# Altium project P1.PrjPcb
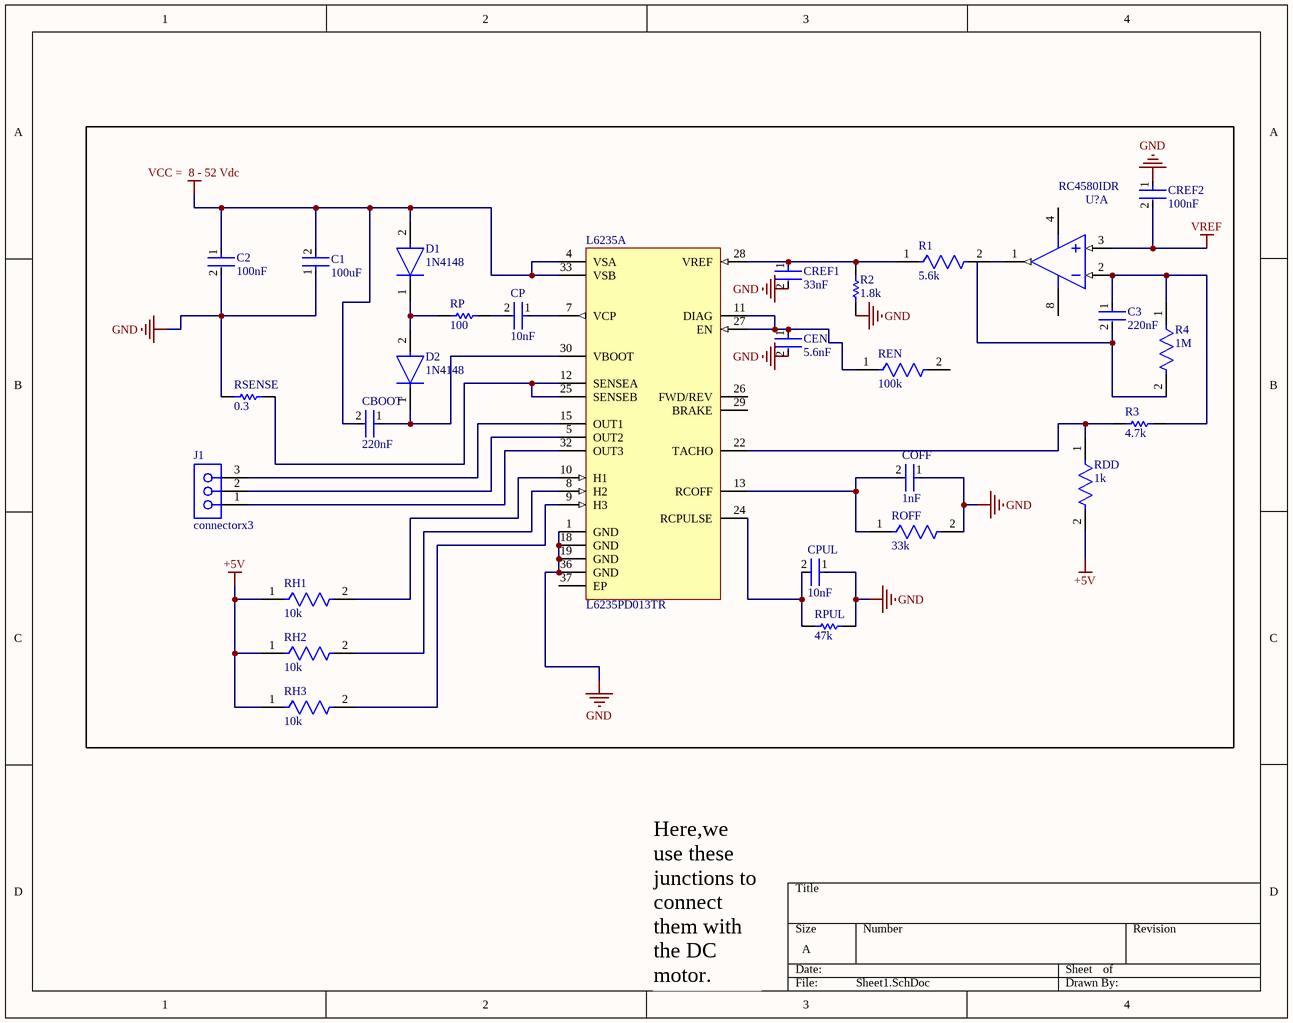
[diagram p0: Sheet1.SchDoc]
1 sheet, 28 parts. Net scope: global (net labels, ports and power ports of the same name join across sheets).
Board file: PCB1.PcbDoc

## Sheet Sheet1.SchDoc
size A; SheetNumber: 1; SheetTotal: 1

### Parts
C1  100uF  [FP-GRM32-0_3-MFG]
C2  100nF  [FP-GRM033-0_03-MFG]
C3  220nF  [FP-1812-L_4_5_0_3-W_3_2_0-MFG]
CBOOT  220nF  [FP-1812-L_4_5_0_3-W_3_2_0-MFG]
CEN  5.6nF  [FP-CC0603-DA-MFG]
COFF  1nF  [FP-0603-L_1_6_0_15-W_0_81-IPC_A]
CP  10nF  [FP-C0805C-DN-MFG]
CPUL  10nF  [FP-C0805C-DN-MFG]
CREF1  33nF  [FP-1206-L_3_2_0_2-W_1_6_0-IPC_B]
CREF2  100nF  [FP-GRM033-0_03-MFG]
D1  1N4148  [FP-017AG-MFG]
D2  1N4148  [FP-017AG-MFG]
J1  connectorx3  [SMTC-SSW-103-22-X-S-VS]
L6235  L6235PD013TR  [STM-PowerSO36-36_V1]  (part A of 2)
R1  5.6k  [FP-ERJ2RK-IPC_A]
R2  1.8k  [RESC1005X40X25LL10T10]
R3  4.7k  [RESC1005X40X25LL05T05]
R4  1M  [FP-HVR37-MFG]
RDD  1k  [FP-ERA3A-IPC_C]
REN  100k  [FP-ERJ2RK-IPC_C]
RH1  10k  [FP-ERA3A-IPC_C]
RH2  10k  [FP-ERA3A-IPC_C]
RH3  10k  [FP-ERA3A-IPC_C]
ROFF  33k  [FP-ERA2A-IPC_B]
RP  100  [RESC1005X40X25NL05T05]
RPUL  47k  [RESC1608X55X30NL15T15]
RSENSE  0.3  [RESC3216X70X50LL05T20]
U?  RC4580IDR  [D0008A_N]  (part A of 2)

### Nets
+5V: RDD.2 RH1.1 RH2.1 RH3.1
GND: C1.1 C2.2 CEN.2 COFF.1 CPUL.1 CREF1.2 CREF2.1 L6235.1(GND) L6235.18(GND) L6235.19(GND) L6235.36(GND) R2.2 ROFF.2 RPUL.2 RSENSE.1
VCC =  8 - 52 Vdc: C1.2 C2.1 CBOOT.2 D1.2(A) L6235.4(VSA) L6235.33(VSB)
VREF: CREF2.2 U?.3(IN1+)
NetC3_1: C3.1 R3.1 R4.1 U?.2(IN1-)
NetC3_2: C3.2 R4.2
NetCBOOT_1: CBOOT.1 D2.1(C) L6235.30(VBOOT)
NetCEN_1: CEN.1 L6235.11(DIAG) L6235.27(EN) REN.1
NetCOFF_2: COFF.2 L6235.13(RCOFF) ROFF.1
NetCP_1: CP.1 L6235.7(VCP)
NetCP_2: CP.2 RP.2
NetCPUL_2: CPUL.2 L6235.24(RCPULSE) RPUL.1
NetCREF1_1: CREF1.1 L6235.28(VREF) R1.1 R2.1
NetD1_1: D1.1(C) D2.2(A) RP.1
NetJ1_1: J1.1 L6235.32(OUT3)
NetJ1_2: J1.2 L6235.5(OUT2)
NetJ1_3: J1.3 L6235.15(OUT1)
NetL6235_8: L6235.8(H2) RH2.2
NetL6235_9: L6235.9(H3) RH3.2
NetL6235_10: L6235.10(H1) RH1.2
NetL6235_12: L6235.12(SENSEA) L6235.25(SENSEB) RSENSE.2
NetL6235_22: L6235.22(TACHO) R3.2 RDD.1
NetR1_2: R1.2 U?.1(OUT1)

Not connected (* = marked no-connect by the designer): L6235 26(FWD/REV) 29(BRAKE) 37(EP); REN 2; U? 4(VCC-) 8(VCC+)

### Notes on the sheet
- Here,we use these junctions to connect them with the DC motor.

### Library data of the parts
C1 = CMP-2000-05259-2: CAP CER 100UF 6.3V X5R 1210; 3DS Part Number: 220-00002; Manufacturer Part Number: GRM32ER60J107ME20L; Manufacturer: Murata; Description: Chip Multilayer Ceramic Capacitors for General; Temperature Coefficient: 15%; Material: Ceramic; Tolerance: 20%; Octopart: https://octopart.com/grm32er60j107me20l-murata-197007; ComponentLink2URL: https://search.murata.co.jp/Ceramy/image/img/A01X/G101/ENG/GRM32ER60J107ME20-01.pdf; Temperature Range High: +85°C; RoHS: TRUE; Device Class L3: Ceramic Capacitors; Device Class L2: Capacitors; Voltage: 6.3V; Package: GRM32-0.3; Voltage Rating: 6.3V; Category: Cap; Device Class L1: Passive Components; Temperature Characteristic: X5R; Automotive: No; Digikey Description: CAP CER 100UF 6.3V X5R 1210; Temperature: -55°C to +85°C; Height: 2.7mm; Ipc Land Pattern Name: CAPC320250X250; Capacitance: 100uF; Temperature Range Low: -55°C; Lead Free: Yes; Value: 100uF; ComponentLink2Description: Datasheet
C2 CREF2 = CMP-06035-000062-2: Chip Multilayer Ceramic Capacitors for General Purpose, 0201, 0.10uF, X5R, 15%, 10%, 6.3V; Min Operating Temperature: -55°C; Lead Free: Lead Free; Radiation Hardening: No; Dielectric: X5R; Voltage Rating (DC): 6.3V; REACH SVHC: No SVHC; Case/Package: 0201; Voltage Rating: 6.3V; Length: 0.6mm; Max Operating Temperature: 85°C; Width: 0.012inch; Depth: 0.3mm; Material: Ceramic; Case Code (Metric): 0603; Thickness: 0.013inch; Packaging: Tape and Reel; Height: 0.3mm; Capacitance: 100nF; Weight: 6E-06oz; Package Quantity: 1; Mount: Surface Mount; Voltage: 6.3V; Case Code (Imperial): 0201; Tolerance: 10%; Termination: SMD/SMT
C3 CBOOT = CMP-1040-01438-2: General Purpose Ceramic Capacitor, 1812, 220nF, 10%, X7R, 15%, 50V; Dissipation Factor: 2.5%; Voltage: 50V; REACH SVHC: No SVHC; Max Operating Temperature: 125°C; Length: 4.5mm; Termination: SMD/SMT; Voltage Rating (DC): 50V; Packaging: Tape and Reel; Contact Plating: Tin; Case Code (Metric): 4532; Radiation Hardening: No; Number of Pins: 2; Mount: Surface Mount; Height: 1.02mm; Lead Free: Lead Free; Dielectric: X7R; Construction: Flat; Capacitance: 220nF; Case/Package: 1812; Tolerance: 10%; Series: 1812; RoHS Compliant: Yes; Voltage Rating: 50V; Package Quantity: 1000; Case Code (Imperial): 1812; Depth: 3.2mm; Thickness: 0.04inch; Min Operating Temperature: -55°C; Width: 0.126inch
CEN = CMP-03422-001341-1: Surface Mount Ceramic Multilayer Capacitor 0.0056uF 10% X7R 50V 0603 Paper T/R; Manufacturer Part Number: CC0603KRX7R9BB562; Manufacturer: YAGEO; Tolerance: 0.1; Temperature Coefficient: 15%; Description: CC0603 5.6 nF X7R 10.00% 50 V; Automotive: No; Category: Cap; RoHS: TRUE; Lead Free: Yes; Temperature Range Low: -55°C; Height: 0.9mm; Material: Ceramic; Device Class L3: Ceramic Capacitors; Digikey Description: Surface Mount Ceramic Multilayer Capacitor 0.0056uF 10% X7R 50V 0603 Paper T/R; Capacitance: 5.6 nF; Device Class L2: Capacitors; Voltage: 50 V; Temperature: -55°C to +125°C; Octopart: https://octopart.com/cc0603krx7r9bb562-yageo-42336084; Package: CC0603-DA; ComponentLink2URL: http://www.yageo.com/documents/recent/UPY-GPHC_X7R_6.3V-to-50V_18.pdf; Device Class L1: Passive Components; Mouser Description: Multilayer Ceramic Capacitors MLCC - SMD/SMT 5.6nF 50V X7R 10%; Temperature Characteristic: X7R; Value: 5.6 nF; Temperature Range High: +125°C; Voltage Rating: 50 V; ComponentLink2Description: Datasheet; Footprint Url: http://www.yageo.com/exep/pages/download/literatures/UPY-C_GEN_24.pdf
COFF = CMP-2006-04378-2: General Purpose Ceramic Capacitor, 0603, 1nF, 10%, X7R, 15%, 50V; Case Code (Metric): 1608; Min Operating Temperature: -55°C; Weight: 7.1E-05oz; Series: -; Capacitance: 1nF; RoHS Compliant: Yes; Radiation Hardening: No; Height: 0.9mm; Mount: Surface Mount; REACH SVHC: No SVHC; Lead Free: Lead Free; Depth: 0.81mm; Voltage: 50V; Number of Pins: 2; Voltage Rating: 50V; Max Operating Temperature: 125°C; Termination: SMD/SMT; Construction: Flat; Case Code (Imperial): 0603; Dielectric: X7R; Width: 0.032inch; Tolerance: 10%; Case/Package: 0603; Contact Plating: Tin; Packaging: Tape and Reel; Voltage Rating (DC): 50V; Dielectric Material: Ceramic; Package Quantity: 4000; Thickness: 0.035inch; Length: 1.6mm
CP CPUL = CMP-2007-00259-2: CAP CER 10000PF 200V X7R 0805; Manufacturer Part Number: C0805C103K2RACTU; Manufacturer: KEMET; Temperature Coefficient: 30ppm/°C; Capacitance: 10,000 pF; Description: C0805 10,000 pF X7R 30ppm/°C 10.00% 200 V; Tolerance: 0.1; Value: 10,000 pF; Device Class L2: Capacitors; Voltage Rating: 200 V; Temperature Range High: +125°C; ComponentLink2Description: Datasheet; Height: 0.88mm; Octopart: https://octopart.com/c0805c103k2ractu-kemet-9138347; Material: Ceramic; ComponentLink2URL: https://content.kemet.com/datasheets/KEM_C1003_C0G_SMD.pdf; Category: Cap; Temperature: -55°C to +125°C; Temperature Range Low: -55°C; Digikey Description: CAP CER 10000PF 200V X7R 0805; Temperature Characteristic: X7R; Automotive: No; Device Class L3: Ceramic Capacitors; Mouser Description: KEMET - C0805C103K2RACTU - CAP, MLCC, X7R, 10NF, 200V, 0805; RoHS: TRUE; Device Class L1: Passive Components; Lead Free: Yes; Package: C0805C-DN; Ipc Land Pattern Name: CAPC200125X78
CREF1 = CMP-04427-000521-1: General Purpose Ceramic Capacitor, 1206, 33nF, 10%, X7R, 15%, 50V; Dissipation Factor: 2.5%; Voltage Rating: 50V; Depth: 1.6mm; Max Operating Temperature: 125°C; Length: 3.2mm; Mount: Surface Mount; Min Operating Temperature: -55°C; Voltage: 50V; Contact Plating: Tin; Dielectric: X7R; Series: -; Width: 1.6mm; Thickness: 0.037inch; Lead Free: Lead Free; Termination: SMD/SMT; Dielectric Material: Ceramic; Number of Pins: 2; Packaging: Tape and Reel; Height: 0.94mm; Construction: Flat; Case/Package: 1206; Voltage Rating (DC): 50V; Case Code (Metric): 3216; RoHS Compliant: Yes; Tolerance: 10%; Case Code (Imperial): 1206; Capacitance: 33nF; Package Quantity: 1
D1 D2 = CMP-07163-000046-1: DIODE GEN PURP 100V 200MA DO35; Forward Voltage: 1V; Max Power Dissipation: 500mW; Max Reverse Current: 5uA; Forward Current: 300mA; Current: 4A; Reverse Recovery Time: 4ns; Element Configuration: Single; Outside Diameter: 1.85mm; Capacitance: 4pF; Polarity: Standard; Max Forward Surge Current (Ifsm): 1A; Reverse Voltage: 100V; Output Current: 200mA; Average Rectified Current: 200mA; Diameter: 1.91mm; Max Repetitive Reverse Voltage (Vrrm): 100V; Current Rating: 200mA; Case/Package: DO-35; Lead Free: Lead Free; Number of Pins: 2; Recovery Time: 4ns; Packaging: Bulk; Contact Plating: Tin; Voltage: 100V; Mount: Through Hole; Max Surge Current: 4A; Package Quantity: 2000; Width: 1.91mm; Max Reverse Voltage (DC): 100V; Length: 4.56mm; Radiation Hardening: No; Power Dissipation: 500mW; Voltage Rating (DC): 100V; Peak Non-Repetitive Surge Current: 4A; REACH SVHC: No SVHC; Height: 4.56mm; Max Operating Temperature: 175°C; Series: -; Weight: 0.01lb; Min Operating Temperature: -65°C
J1 = CMP-1023-00333-1: SQ Post Socket, Surface Mount, Vertical, -55 to 125 degC, 2.54 mm Pitch, 3-Pin, Female, RoHS; PartNumber: SSW-103-22-G-S-VS; Manufacturer: Samtec; Pitch: 2.54 mm; PackageDescription: .100 [2.54] Surface Mount Assembly; ComponentLink3Description: Package Specification; ComponentLink1Description: Manufacturer URL; PackageVersion: AS, 1/1997; ComponentLink2Description: Datasheet; RoHS: True; ComponentLink2URL: http://www.samtec.com/documents/webfiles/pdf/SSW_SM.PDF; PackageReference: SSW-103-22-X-S-VS; Temperature Range: -55 to 125 degC; Orientation: Vertical; ComponentLink1URL: http://www.samtec.com; ComponentLink3URL: http://www.samtec.com/documents/webfiles/cpdf/SSW-1XX-22-XXX-X-XX-XX-X-XX-MKT.pdf; DatasheetVersion: F-214; Mounting Technology: Surface Mount
L6235 = CMP-1005-00003-1: DMOS Driver for 3-Phase Brushless DC Motor, 12 to 52 V, 2.8 A, -40 to 150 degC, 36-Pin SOP (PowerSO36), RoHS; Manufacturer: STMicroelectronics; Vth(OFF): 1.3 V Typ.; Iout: 2.8 A; Vth(ON): 1.8 V Typ.; Is: 5 mA Typ.; PartNumber: L6235PD013TR; Supply Voltage: 12 to 52 V; ComponentLink1Description: Manufacturer URL; ComponentLink2URL: http://www.st.com/st-web-ui/static/active/en/resource/technical/document/datasheet/CD00002347.pdf; ComponentLink2Description: Datasheet; Mounting Technology: Surface Mount; RoHS: TRUE; DatasheetVersion: Rev. 2; ComponentLink3Description: Package Specification; ComponentLink3URL: http://www.icbuy.com/education/package/mode_name/upload/education/package/061104/1157210448562001162612641.pdf; PackageDescription: 36-Pin Small Outline Package, Body 15.9 x 11 mm, Pitch 0.65 mm; Operating Temperature Range: -40 to 150 degC; ComponentLink1URL: http://www.st.com/
R1 = CMP-1011-00595-3: RES SMD 5.6K OHM 1% 1/10W 0402; Voltage Rating: 50V; Resistance: 5.6kR; Power Rating: 100mW; Temperature Coefficient: 100ppm/°C; Width: 0.02inch; Packaging: Tape and Reel; Case Code (Imperial): 0402; Max Operating Temperature: 155°C; Features: Automotive AEC-Q200; Length: 1mm; Military Standard: Not; Number of Pins: 2; RoHS Compliant: Yes; Lead Free: Lead Free; Contact Plating: Tin; Radiation Hardening: No; Depth: 0.5mm; Tolerance: 1%; Number of Terminations: 2; Height: 0.35mm; REACH SVHC: Yes; Technology: THICK FILM; Case/Package: 0402; Resistor Type: Thick Film; Mount: Surface Mount; Min Operating Temperature: -55°C; Termination: SMD/SMT; Weight: 2.8E-05oz; Max Power Dissipation: 100mW; Resistance Tolerance: 1%; Voltage Rating (DC): 50V; Series: ERJ; Package Quantity: 1; Construction: Rectangular; Case Code (Metric): 1005
R2 = CMP-2002-05787-1: Part Number: ERA-2AEB182X; Manufacturer: Panasonic
R3 = CMP-2002-01154-4: Chip Resistor, 4.7 KOhm, +/- 1%, 0.1 W, -55 to 155 degC, 0402 (1005 Metric), RoHS, Tape and Reel; PartNumber: ERJ-2RKF4701X; Voltage Rating: 50 V; Case\/Package: 0402; Power Rating: 100 mW; Height: 0.35 mm; Mounting Technology: Surface Mount; REACH SVHC: Yes; Resistance: 4.7 KOhm; Max Operating Temperature: 155 degC; ComponentLink1Description: Manufacturer URL; ComponentLink2Description: Datasheet; Pins: 2; PackageReference: 0402; Tolerance: 1%; Case Code (Imperial): 0402; Length: 1 mm; PackageDescription: 2-Pin Surface Mount Device, Body 1 x 0.5 mm; RoHSCompliant: true; Package Quantity: 1; Radiation Hardening: No; DatasheetVersion: 04/2015; Width: 0.5 mm; Case Code (Metric): 1005; Mount: Surface Mount; ComponentLink1URL: http://www.panasonic.com/; Min Operating Temperature: -55 degC; Packaging: Cut Tape; ComponentLink2URL: http://industrial.panasonic.com/cdbs/www-data/pdf/RDA0000/AOA0000C86.pdf
R4 = CMP-00030-42845042-1: HVR3700001004FR500 Fixed Resistor, Metal Film, 0.5W, 1000000ohm, 3500V, 1% +/-Tol, 200ppm/Cel, Through Hole Mount; Resistance: 1MΩ; Voltage Rating: 3.5kV; Max Power Dissipation: 500mW; Lead Diameter: 780µm; Temperature Coefficient: 200ppm/°C; Number of Pins: 2; Composition: Metal Film; Features: Flame Retardant Coating; Schedule B: 8533210090, 8533210090; RoHS: Compliant; Voltage Rating (DC): 3.5kV; Min Operating Temperature: -55°C; REACH SVHC: Unknown; Tolerance: 1%; Termination: Axial; Radiation Hardening: No; Height: 4mm; Packaging: Cut Tape (CT); Length: 10.0076mm; Number of Terminations: 2; Max Operating Temperature: 155°C; Power Rating: 500mW; NexarPartId: 42845042; Lead Free: Lead Free; Case/Package: Axial
RDD = CMP-2000-00873-2: RES SMD 1K OHM 0.1% 1/10W 0603; Temperature Coefficient: 25ppm/°C; Voltage Rating: 75V; Max Power Dissipation: 100mW; Resistance: 1kR; Technology: METAL FILM; Number of Pins: 2; Packaging: Tape and Reel; Case Code (Imperial): 0603; Case Code (Metric): 1608; Min Operating Temperature: -55°C; REACH SVHC: No SVHC; Length: 1.6mm; Termination: SMD/SMT; Depth: 0.8mm; Resistance Tolerance: 0.1%; Number of Terminations: 2; Width: 0.8mm; Military Standard: Not; Tolerance: 0.1%; Package Quantity: 5000; Contact Plating: Tin; Height: 0.45mm; Construction: Rectangular; Case/Package: 0603; Max Operating Temperature: 155°C; Resistor Type: Thin Film; Series: ERA-3A; Size Code: 0603; RoHS Compliant: Yes; Mount: Surface Mount; Radiation Hardening: No; Power Rating: 100mW
REN = CMP-2002-00608-4: RES SMD 100K OHM 1% 1/10W 0402; Resistance: 100kR; Voltage Rating (DC): 50V; Power Rating: 100mW; Temperature Coefficient: 100ppm/°C; Case/Package: 0402; Length: 1mm; Package Quantity: 1; Radiation Hardening: No; Case Code (Metric): 1005; Contact Plating: Tin; Mount: Surface Mount; Depth: 0.5mm; Max Operating Temperature: 155°C; Lead Free: Lead Free; Width: 0.5mm; Composition: Thick Film; Case Code (Imperial): 0402; Tolerance: 1%; Termination: SMD/SMT; Number of Pins: 2; Height: 0.35mm; Voltage Rating: 50V; Military Standard: Not; REACH SVHC: No SVHC; Packaging: Tape and Reel; Min Operating Temperature: -55°C; Max Power Dissipation: 100mW; Features: Automotive AEC-Q200; Number of Terminations: 2
RH1-RH3 = CMP-2000-00874-2: RES SMD 10K OHM 0.1% 1/10W 0603; Voltage Rating (DC): 75V; Power Rating: 100mW; Resistance: 10kR; Temperature Coefficient: 25ppm/°C; Radiation Hardening: No; Width: 0.8mm; Depth: 0.8mm; Construction: Rectangular; Case Code (Metric): 1608; Package Quantity: 5000; Length: 1.6mm; Size Code: 0603; Case Code (Imperial): 0603; Termination: SMD/SMT; Contact Plating: Tin; Resistance Tolerance: 0.1%; Military Standard: Not; Packaging: Tape and Reel; Max Power Dissipation: 100mW; REACH SVHC: No SVHC; Series: ERA-3A; Voltage Rating: 75V; Lead Free: Lead Free; Technology: METAL FILM; RoHS Compliant: Yes; Max Operating Temperature: 155°C; Resistor Type: Thin Film; Min Operating Temperature: -55°C; Number of Pins: 2; Case/Package: 0603; Tolerance: 0.1%; Height: 0.45mm; Mount: Surface Mount; Number of Terminations: 2
ROFF = CMP-2002-05885-2: RES SMD 33K OHM 0.1% 1/16W 0402; Voltage Rating (DC): 25V; Max Power Dissipation: 63mW; Temperature Coefficient: 25ppm/°C; Voltage Rating: 50V; Resistance: 33kR; Series: ERA-2A; Construction: Rectangular; Military Standard: Not; Max Operating Temperature: 155°C; Contact Plating: Tin; Mount: Surface Mount; Technology: METAL FILM; Number of Terminations: 2; Resistance Tolerance: 0.1%; Case/Package: 0402; Termination: SMD/SMT; Length: 1mm; Height: 0.35mm; Case Code (Metric): 1005; Min Operating Temperature: -55°C; RoHS Compliant: Yes; Number of Pins: 2; Power Rating: 63mW; Resistor Type: Thin Film; Radiation Hardening: No; Lead Free: Lead Free; Width: 0.5mm; Packaging: Tape and Reel; Tolerance: 0.1%; Case Code (Imperial): 0402; Depth: 0.5mm; Package Quantity: 10000
RP = CMP-2002-01176-1: Part Number: ERT-J0EA101J; Manufacturer: Panasonic
RPUL = CMP-2000-00523-2: Chip Resistor, 47 KOhm, +/- 1%, 0.1 W, -55 to 155 degC, 0603 (1608 Metric), RoHS, Tape and Reel; Case\Package: 0603; Forward Current: 20 mA; Power Rating: 90 mW; Illumination Colour: Red; Nominal Vf: 2.1 V; Viewing Angle: 160 degrees; Luminous Intensity: 63 mcd; Lens Style: Clear; Nominal Wavelength: 639 nm; Case Code (Imperial): 0603; Case Code (Metric): 1608; Packaging: Tape and Reel; Radiation Hardening: No; Colour: Red; PackageDescription: 2-Pin Surface Mount Device, Body 1.6 x 0.85 mm; ComponentLink1Description: Manufacturer URL; Width: 0.8 mm; DatasheetVersion: Apr-15; ComponentLink2URL: http://industrial.panasonic.com/cdbs/www-data/pdf/RDA0000/AOA0000C86.pdf; Min Operating Temperature: -40 degC; Height: 0.6 mm; Package Quantity: 3000; ComponentLink2Description: Datasheet; REACH SVHC: No SVHC; ComponentLink1URL: http://www.panasonic.com/; Mount: Surface Mount; RoHSCompliant: true; Max Operating Temperature: 100 degC; PackageReference: 0603; Length: 1.6 mm; Forward Voltage: 2.1 V; Pins: 2
RSENSE = CMP-2003-00750-1: Manufacturer: Panasonic; Part Number: ERJ8BQFR30V
U? = CMP-0017-00578-2: Dual Audio Operational Amplifier, 4 to 32 V, -40 to 85 degC, 8-pin SOIC (D8), Green (RoHS & no Sb/Br); Manufacturer: Texas Instruments; Iq per channel(Max)(mA): 4.5; Total Supply Voltage(Max)(+5V is 5, +/-5V is 10): 32; Vn at 1kHz(Typ)(nV/rtHz): 6.2; Vio (25C)(Max)(mV): 3; CMRR(Min)(dB): 80; Number of Channels: 2; GBW(Typ)(MHz): 12; Total Supply Voltage(Min)(+5V is 5, +/-5V is 10): 4; Sub Family: General Purpose Amplifier, High Supply Voltage Amplifier (>=30V), Low Noise Amp (<=10nV/rtHz); IIB(Max)(pA): 500000; Slew Rate(Typ)(V/us): 5; ComponentLink3Description: Package Specification; Mounting Technology: Surface Mount; Eco-Plan: Green (RoHS & no Sb/Br); DatasheetVersion: SLOS412C; ComponentLink1URL: http://www.ti.com/; PackageDescription: 8-Pin Plastic Small Outline, Body 4.9 x 3.9 mm, Pitch 1.27 mm; PartNumber: RC4580IDR; Code_JEDEC: MS-012; ComponentLink2URL: http://www.ti.com/lit/ds/symlink/rc4580.pdf; ComponentLink2Description: Datasheet; PackageVersion: 4040047-3/M, 06/2011; ComponentLink1Description: Manufacturer URL; ComponentLink3URL: http://www.ti.com/litv/pdf/msoi002j; PackageReference: D0008A